# EAGLE design sensorTemperatura (EAGLE 5.10)
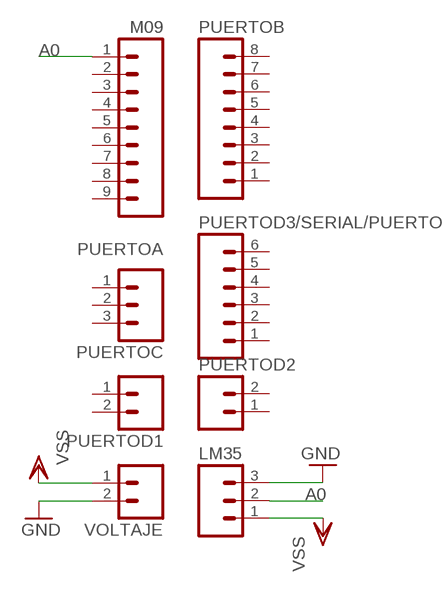
[diagram p0: schematic, sheet 1]

## Parts
LM35  M03PTH  [1X03]
PUERTOA  M09  [1X09]
PUERTOB  M08  [1X08]
PUERTOC  M03PTH  [1X03]
PUERTOD1  M02PTH  [1X02]
PUERTOD2  M02PTH  [1X02]
PUERTOD3/SERIAL/PUERTOE  M06SIP  [1X06]
VOLTAJE  M02PTH  [1X02]

## Nets
A0: LM35.2 PUERTOA.1
GND: LM35.3 VOLTAJE.2
VSS: LM35.1 VOLTAJE.1
Unconnected: PUERTOA.2 PUERTOA.3 PUERTOA.4 PUERTOA.5 PUERTOA.6 PUERTOA.7 PUERTOA.8 PUERTOA.9 PUERTOB.1 PUERTOB.2 PUERTOB.3 PUERTOB.4 PUERTOB.5 PUERTOB.6 PUERTOB.7 PUERTOB.8 PUERTOC.1 PUERTOC.2 PUERTOC.3 PUERTOD1.1 PUERTOD1.2 PUERTOD2.1 PUERTOD2.2 PUERTOD3/SERIAL/PUERTOE.1 PUERTOD3/SERIAL/PUERTOE.2 PUERTOD3/SERIAL/PUERTOE.3 PUERTOD3/SERIAL/PUERTOE.4 PUERTOD3/SERIAL/PUERTOE.5 PUERTOD3/SERIAL/PUERTOE.6

## Library data of the parts
LM35 PUERTOC = SparkFun:M03: Header 3 Standard 3-pin 0.1" header. Use with straight break away headers (SKU : PRT-00116), right angle break away headers (PRT-00553), swiss pins (PRT-00743), machine pins (PRT-00117), and female headers (PRT-00115). Molex polarized connector foot print use with SKU : PRT-08232 with associated crimp pins and housings.
PUERTOA = SparkFun:M09: Header 9 Standard 9-pin 0.1" header. Use with straight break away headers (SKU : PRT-00116), right angle break away headers (PRT-00553), swiss pins (PRT-00743), machine pins (PRT-00117), and female headers (PRT-00115).
PUERTOB = SparkFun:M08: Header 8 Standard 8-pin 0.1" header. Use with straight break away headers (SKU : PRT-00116), right angle break away headers (PRT-00553), swiss pins (PRT-00743), machine pins (PRT-00117), and female headers (PRT-00115).
PUERTOD1 PUERTOD2 VOLTAJE = SparkFun:M02: Header 2 Standard 2-pin 0.1" header. Use with straight break away headers (SKU : PRT-00116), right angle break away headers (PRT-00553), swiss pins (PRT-00743), machine pins (PRT-00117), and female headers (PRT-00115). Molex polarized connector foot print use with SKU : PRT-08233 with associated crimp pins and housings.
PUERTOD3/SERIAL/PUERTOE = SparkFun:M06: Header 6 Standard 6-pin 0.1" header. Use with straight break away headers (SKU : PRT-00116), right angle break away headers (PRT-00553), swiss pins (PRT-00743), machine pins (PRT-00117), and female headers (PRT-00115). Molex polarized connector foot print use with SKU : PRT-08094 with associated crimp pins and housings. NOTES ON THE VARIANTS LOCK and LOCK_LONGPADS... This footprint was designed to help hold the alignment of a through-hole component (i.e. 6-pin header) while soldering it into place. You may notice that each hole has been shifted either up or down by 0.005 of an inch from it's more standard position (which is a perfectly straight line). This slight alteration caused the pins (the squares in the middle) to touch the edges of the holes. Because they are alternating, it causes a "brace" to hold the component in place. 0.005 has proven to be the perfect amount of "off-center" position when using our standard breakaway headers. Although looks a little odd when you look at the bare footprint, once you have a header in there, the alteration is very hard to notice. Also, if you push a header all the way into place, it is covered up entirely on the bottom side. This idea of altering the position of holes to aid alignment will be further integrated into the Sparkfun Library for other footprints. It can help hold any component with 3 or more connection pins.

## Board
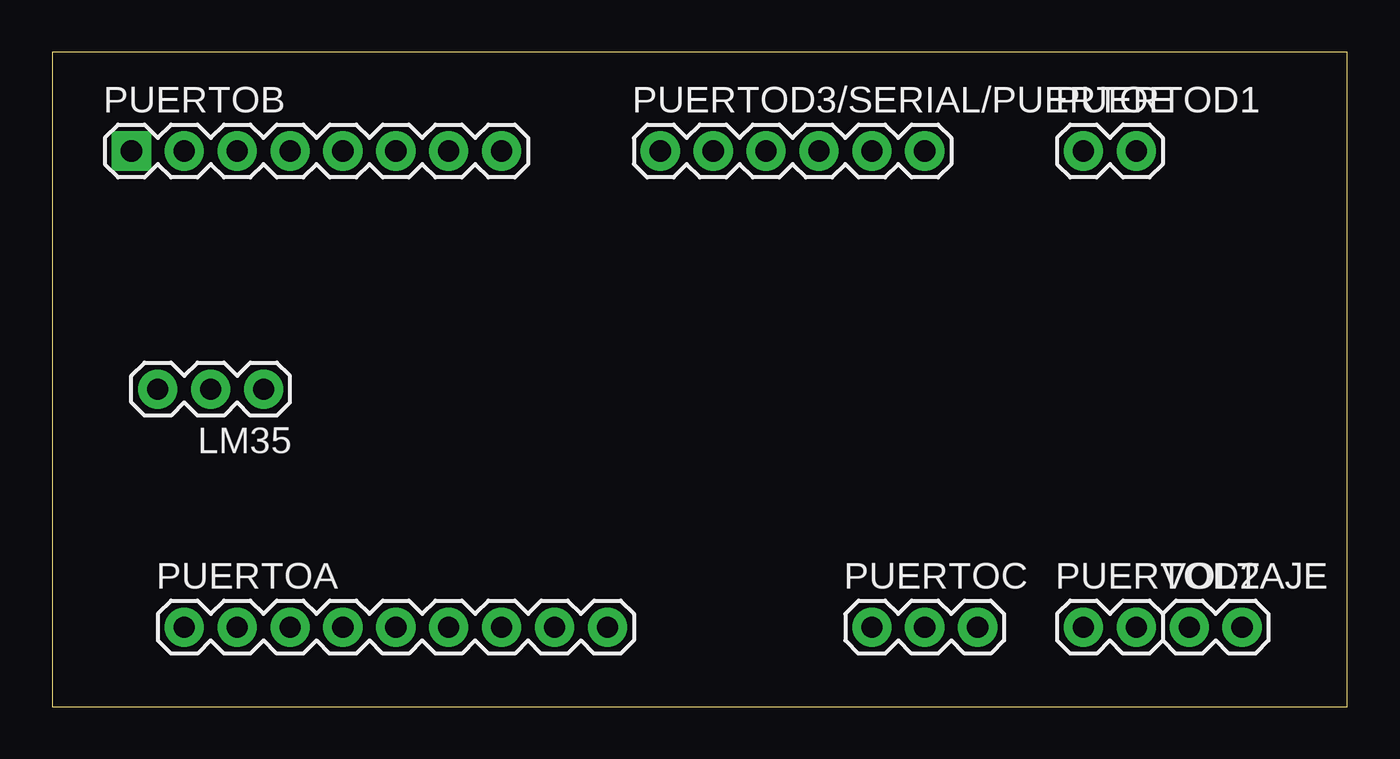
[diagram p1: board, top side]
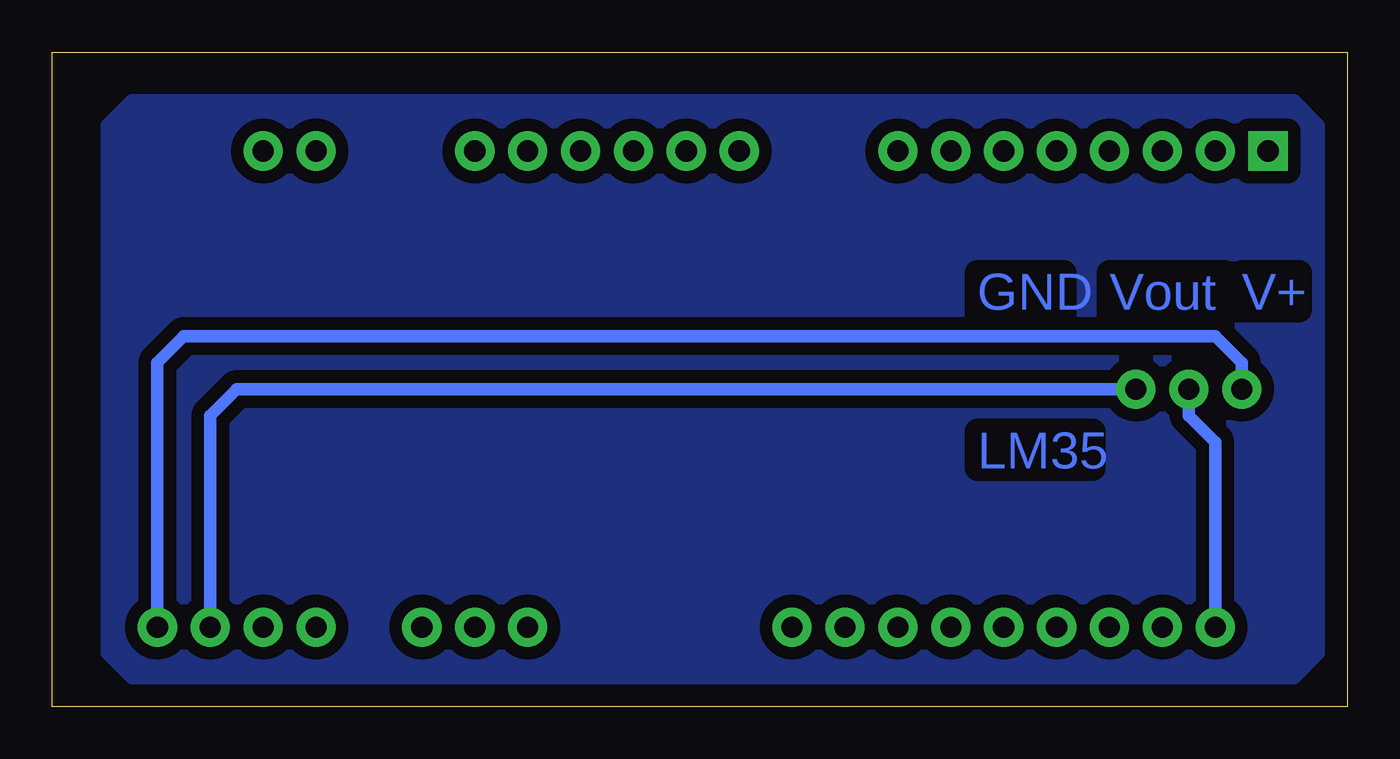
[diagram p2: board, bottom side, seen from below]

Size 62.21 x 31.42 mm. Coordinates in mm from the lower left corner, seen from the top.
Outline: 0,0 62.21,0 62.21,31.42 0,31.42 0,0
Copper layers (1*16): Top 0.035mm / dielectric 1.5mm / Bottom 0.035mm
Design rules "default": minimum track width 10mil, minimum drill 24mil, track to track 8mil, track to pad 8mil, pad to pad 8mil, via to via 8mil, smd to smd 8mil, copper to edge 40mil, drill to drill 8mil, minimum pad ring 10mil, minimum via ring 8mil, stop-mask expansion 4mil, vias tented up to drill 0mil, thermal gap 10mil

### Footprints (pad centres in the part's own frame; a part is rotated, then mirrored left to right if it is on the bottom)
1X03 = drill 1.016 pad 1.88 round: 1 0,0; 2 2.54,0; 3 5.08,0
1X09 = drill 1.016 pad 1.88 round: 1 0,0; 2 2.54,0; 3 5.08,0; 4 7.62,0; 5 10.16,0; 6 12.7,0; 7 15.24,0; 8 17.78,0; 9 20.32,0
1X08 = drill 1.016 pad 1.88 square: 1 0,0 | drill 1.016 pad 1.88 round: 2 2.54,0; 3 5.08,0; 4 7.62,0; 5 10.16,0; 6 12.7,0; 7 15.24,0; 8 17.78,0
1X02 = drill 1.016 pad 1.88 round: 1 0,0; 2 2.54,0
1X06 = drill 1.016 pad 1.88 round: 1 0,0; 2 2.54,0; 3 5.08,0; 4 7.62,0; 5 10.16,0; 6 12.7,0

### Placement (x,y rotation side)
LM35  10.16,15.24 180 top
PUERTOA  6.35,3.81 0 top
PUERTOB  3.81,26.67 0 top
PUERTOC  39.37,3.81 0 top
PUERTOD1  49.53,26.67 0 top
PUERTOD2  49.53,3.81 0 top
PUERTOD3/SERIAL/PUERTOE  29.21,26.67 0 top
VOLTAJE  54.61,3.81 0 top

### Tracks (layer width: path | path; a pad name or v marks a point on that pad's centre or on a via)
A0
  Bottom 0.61: LM35.2 7.62,13.97 6.35,12.7 PUERTOA.1
GND
  Bottom 0.61: LM35.3 5.08,16.51 6.35,17.78 55.88,17.78 57.15,16.51 VOLTAJE.2
N$1
  pour Bottom (isolate 0.61): 58.42,29.21 2.54,29.21 1.27,27.94 1.27,2.54 2.54,1.27 58.42,1.27 59.69,2.54 59.69,27.94
VSS
  Bottom 0.61: LM35.1 53.34,15.24 54.61,13.97 VOLTAJE.1

### Text on the board
Bottom: V+ | Vout | GND | LM35